# Altium schematic sheet IMU.SchDoc
size A; DocumentNumber: 5; SheetNumber: 5; SheetTotal: 16
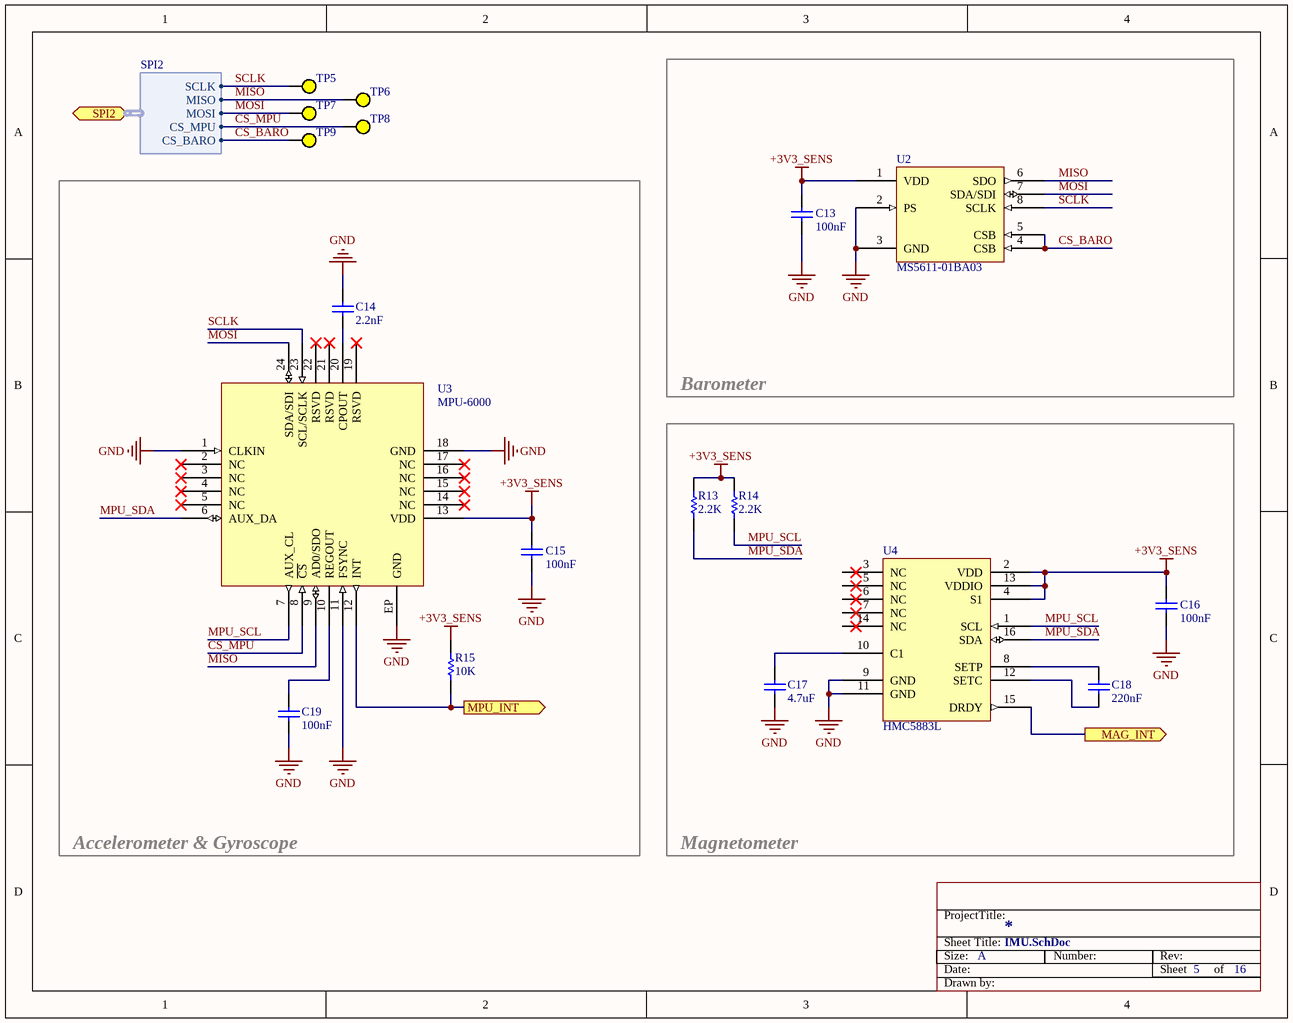
[diagram p0: IMU.SchDoc]

## Parts
C13  value 100nF  [CAP_0402[1005M]]  (hidden comment: Cap)
C14  value 2.2nF  [CAP_0402[1005M]]  (hidden comment: CAP)
C15  value 100nF  [CAP_0402[1005M]]  (hidden comment: Cap)
C16  value 100nF  [CAP_0402[1005M]]  (hidden comment: Cap)
C17  value 4.7uF  [CAP_0402[1005M]]  (hidden comment: Cap)
C18  value 220nF  [CAP_0402[1005M]]  (hidden comment: Cap)
C19  value 100nF  [CAP_0402[1005M]]  (hidden comment: Cap)
R13  value 2.2K  [RES_0402[1005M]]  (hidden comment: RES)
R14  value 2.2K  [RES_0402[1005M]]  (hidden comment: RES)
R15  value 10K  [RES_0402[1005M]]  (hidden comment: RES)
TP5  Test Point SIG  [TP_SMD_1_SILK]  (value not drawn)  (no BOM)
TP6  Test Point SIG  [TP_SMD_1_SILK]  (value not drawn)  (no BOM)
TP7  Test Point SIG  [TP_SMD_1_SILK]  (value not drawn)  (no BOM)
TP8  Test Point SIG  [TP_SMD_1_SILK]  (value not drawn)  (no BOM)
TP9  Test Point SIG  [TP_SMD_1_SILK]  (value not drawn)  (no BOM)
U2  MS5611-01BA03  [MS5611-01BA03]
U3  MPU-6000  [QFN24]
U4  HMC5883L  [QFN16]

## Blocks framed on the sheet
Barometer: C13 U2
Accelerometer & Gyroscope: C14 C15 C19 R15 U3
Magnetometer: C16-C18 R13 R14 U4

## Ports
MAG_INT (out), MPU_INT (out), SPI2 (harness SPI2)

## Harnesses
SPI2: SCLK, MOSI, MISO, CS_MPU, CS_BARO

## Nets
+3V3_SENS: C13.1 C15.1 C16.1 R13.2 R14.2 R15.2 U2.1(VDD) U3.13(VDD) U4.2(VDD) U4.4(S1) U4.13(VDDIO)
GND: C13.2 C14.2 C15.2 C16.2 C17.2 C19.1 U2.2(PS) U2.3(GND) U3.1(CLKIN) U3.11(FSYNC) U3.18(GND) U3.EP(GND) U4.9(GND) U4.11(GND)
CS_BARO: TP9.1 U2.4(CSB) U2.5(CSB) ; port SPI2.CS_BARO
CS_MPU: TP8.1 U3.8(~{CS}) ; port SPI2.CS_MPU
MAG_INT: U4.15(DRDY) ; port MAG_INT
MISO: TP6.1 U2.6(SDO) U3.9(AD0/SDO) ; port SPI2.MISO
MOSI: TP7.1 U2.7(SDA/SDI) U3.24(SDA/SDI) ; port SPI2.MOSI
MPU_INT: R15.1 U3.12(INT) ; port MPU_INT
MPU_SCL: R14.1 U3.7(AUX_CL) U4.1(SCL)
MPU_SDA: R13.1 U3.6(AUX_DA) U4.16(SDA)
SCLK: TP5.1 U2.8(SCLK) U3.23(SCL/SCLK) ; port SPI2.SCLK
NetC14_1: C14.1 U3.20(CPOUT)
NetC17_1: C17.1 U4.10(C1)
NetC18_1: C18.1 U4.8(SETP)
NetC18_2: C18.2 U4.12(SETC)
NetC19_2: C19.2 U3.10(REGOUT)

Not connected (* = marked no-connect by the designer): U3 2(NC)* 3(NC)* 4(NC)* 5(NC)* 14(NC)* 15(NC)* 16(NC)* 17(NC)* 19(RSVD)* 21(RSVD)* 22(RSVD)*; U4 3(NC) 5(NC) 6(NC) 7(NC) 14(NC)

## Notes on the sheet
- Sheet Title:
- ProjectTitle:
- Size:
- Date:
- A
- Number:
- Rev:
- Sheet         of
- Drawn by:

## Library data of the parts
C13 C15 C16 C19 = Cap: Capacitor; Manufacturer: Yageo; Manufacturer Part Number: CC0402KRX7R6BB104; Supplier 1: Digi-Key; Supplier Part Number 1: 311-1345-1-ND; ComponentLink1URL: http://www.yageo.com/documents/recent/UPY-GPHC_X7R_6.3V-to-50V-v12.pdf; ComponentLink1Description: Datasheet
C14 = CAP: Capacitor; Manufacturer: Yageo; Manufacturer Part Number: CC0402KRX7R9BB222; Supplier 1: Digi-Key; Supplier Part Number 1: 311-1037-1-ND; ComponentLink1URL: http://www.yageo.com/documents/recent/UPY-GPHC_X7R_6.3V-to-50V-v12.pdf; ComponentLink1Description: Datasheet
C17 = Cap: Capacitor; Manufacturer: Yageo; Manufacturer Part Number: CC0402MRX5R6BB475; Supplier 1: Digi-Key; Supplier Part Number 1: 311-1734-1-ND; ComponentLink1URL: http://www.yageo.com/documents/recent/UPY-GPHC_X5R_4V-to-50V_19.pdf; ComponentLink1Description: Datasheet
C18 = Cap: Capacitor; Manufacturer: Yageo; Manufacturer Part Number: CC0402KRX5R5BB224; Supplier 1: Digi-Key; Supplier Part Number 1: 311-1681-1-ND; ComponentLink1URL: http://www.yageo.com/documents/recent/UPY-GPHC_X5R_4V-to-50V_19.pdf; ComponentLink1Description: Datasheet
R13 R14 = RES: Resistor; Manufacturer Part Number: RC0402FR-072K2L; Manufacturer: Yageo; Supplier 1: Digi-Key; Supplier Part Number 1: 311-2.20KLRCT-ND; ComponentLink1URL: http://www.yageo.com/NewPortal/yageodocoutput?fileName=/pdf/R-Chip/PYu-RC_Group_51_RoHS_L_3.pdf; ComponentLink1Description: Datasheet
R15 = RES: Resistor; Manufacturer: Yageo; Manufacturer Part Number: RC0402FR-0710KL; Supplier 1: Digi-Key; Supplier Part Number 1: 311-10.0KLRCT-ND; ComponentLink1URL: http://www.yageo.com/NewPortal/yageodocoutput?fileName=/pdf/R-Chip/PYu-RC_Group_51_RoHS_L_3.pdf; ComponentLink1Description: Datasheet
TP5-TP9 = Test Point SIG: Test Point Signal
U2 = MS5611-01BA03: MS5611-01BA03 Barometer, Altimeter; Manufacturer: Measurement Specialties, Inc.; Manufacturer Part Number: MS5611-01BA03; Supplier 2: Component Distributors, Inc.; Supplier Part Number 2: MS5611-01BA03; Supplier 4: Newark; Supplier Part Number 4: 20X0212; ComponentLink1URL: http://www.mouser.com/ds/2/418/MS5611-01BA03-769655.pdf; ComponentLink1Description: Datasheet; Supplier 3: Mouser; Supplier Part Number 3: 824-MS561101BA03-00; Supplier 1: Digi-Key; Supplier Part Number 1: 223-1622-1-ND
U3 = MPU-6000: Invense MPU-6000 6 Axis Motion Sensor; Manufacturer: InvenSense; Manufacturer Part Number: MPU-6000; Supplier 2: InvenSense; Supplier Part Number 2: MPU-6000; Supplier 1: Digi-Key; Supplier Part Number 1: 1428-1005-2-ND; ComponentLink1URL: http://store.invensense.com/datasheets/invensense/MPU-6050_DataSheet_V3%204.pdf; ComponentLink1Description: Datasheet
U4 = HMC5883L: HMC5883L 3-axis Magnetometer; Manufacturer: Honeywell Microelectronics & Precision Sensors; Manufacturer Part Number: HMC5883L-TR; Supplier 1: Digi-Key; Supplier Part Number 1: 342-1082-1-ND; ComponentLink1URL: http://www51.honeywell.com/aero/common/documents/myaerospacecatalog-documents/Defense_Brochures-documents/HMC5883L_3-Axis_Digital_Compass_IC.pdf; ComponentLink1Description: Datasheet